# Altium schematic sheet level_shift.SchDoc
size A4; SheetNumber: 4; SheetTotal: 5
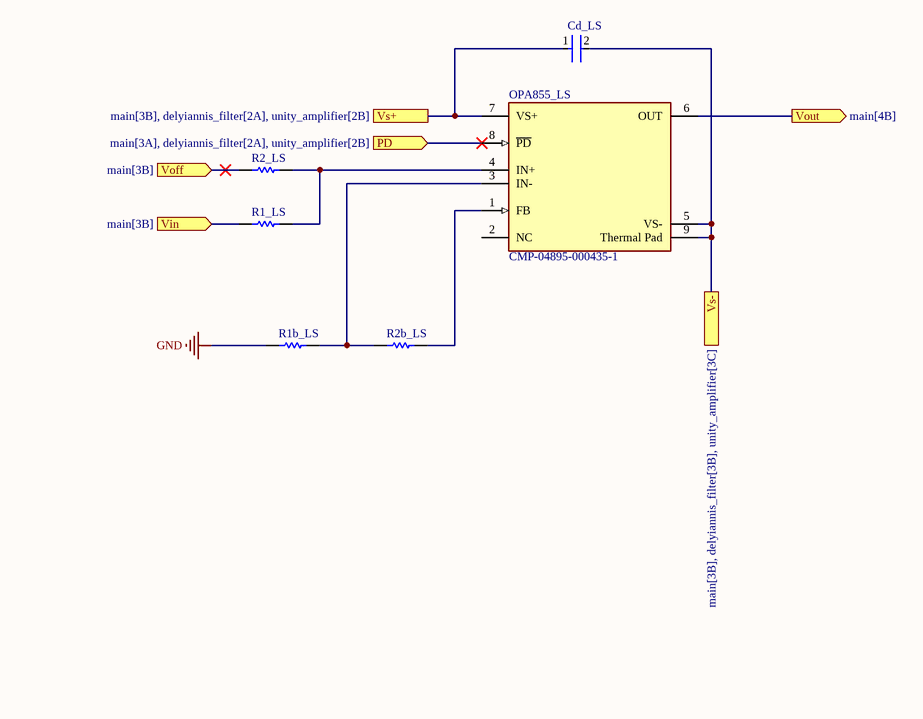
[diagram p0: level_shift.SchDoc]

## Parts
Cd_LS  C0402C104K4RACTU  [FP-C0402-BB-MFG]  (value not drawn)
OPA855_LS  CMP-04895-000435-1  [FP-DSG0008A-MFG]
R1_LS  RC0402FR-07100RL  [RESC1005X40X25ML05T10]  (value not drawn)
R1b_LS  RC0402FR-07100RL  [RESC1005X40X25ML05T10]  (value not drawn)
R2_LS  RC0402FR-07100RL  [RESC1005X40X25ML05T10]  (value not drawn)
R2b_LS  RC0402FR-07100RL  [RESC1005X40X25ML05T10]  (value not drawn)

## Ports
PD (in, see main[3A], delyiannis_filter[2A], unity_amplifier[2B]), Vin (in, see main[3B]), Voff (in, see main[3B]), Vout (out, see main[4B]), Vs+ (see main[3B], delyiannis_filter[2A], unity_amplifier[2B]), Vs- (see main[3B], delyiannis_filter[3B], unity_amplifier[3C])

## Nets
GND: R1b_LS.1
PD: OPA855_LS.8(~{PD}) ; port PD
Vin: R1_LS.1 ; port Vin
Voff: R2_LS.1 ; port Voff
Vout: OPA855_LS.6(OUT) ; port Vout
Vs+: Cd_LS.1 OPA855_LS.7(VS+) ; port Vs+
Vs-: Cd_LS.2 OPA855_LS.5(VS-) OPA855_LS.9(Thermal_Pad) ; port Vs-
NetOPA855_LS_1: OPA855_LS.1(FB) R2b_LS.2
NetOPA855_LS_3: OPA855_LS.3(IN-) R1b_LS.2 R2b_LS.1
NetOPA855_LS_4: OPA855_LS.4(IN+) R1_LS.2 R2_LS.2

Not connected (* = marked no-connect by the designer): OPA855_LS 2(NC)

## Library data of the parts
Cd_LS = CMP-2008-02108-2: CAP CER 0.1UF 16V X7R 0402; Manufacturer: Kemet; Value: 0.10 μF; Tolerance: 0.1; Temperature Coefficient: 15%; Voltage Rating: 16 V; Package: C0402-BB; Automotive: No; Ipc Land Pattern Name: CAPC10050X50; Device Class L3: Ceramic Capacitors; Capacitance: 0.10 μF; Octopart: https://octopart.com/c0402c104k4ractu-kemet-94158; Temperature Characteristic: X7R; Mouser Description: Cap Ceramic 0.1uF 16V X7R 10% SMD 0402 125?C Paper T/R - Tape and Reel (Alt: C0402C104K4RAC TU); ComponentLink2Description: Datasheet; Temperature Range Low: -55°C; RoHS: TRUE; Device Class L1: Passive Components; Manufacturer Part Number: C0402C104K4RACTU; Material: Ceramic; Temperature Range High: +125°C; Device Class L2: Capacitors; ComponentLink2URL: https://content.kemet.com/datasheets/KEM_C1002_X7R_SMD.pdf; Category: Cap; Height: 0.55mm; Temperature: -55°C to +125°C; Lead Free: Yes; Digikey Description: CAP CER 0.1UF 16V X7R 0402
OPA855_LS = CMP-007-000000-2: IC OPAMP GP 1 CIRCUIT 8WSON; Source: Components - 05.10.22 - 21.23.SchLib; RoHS Compliant: Yes; Design Item ID: CMP-04895-000435-1
R1_LS R1b_LS R2_LS R2b_LS = CMP-2002-07344-1: Manufacturer: Yageo / Phycomp; Part Number: RC0402FR-07100RL